# EAGLE design target (EAGLE 6.5.0)
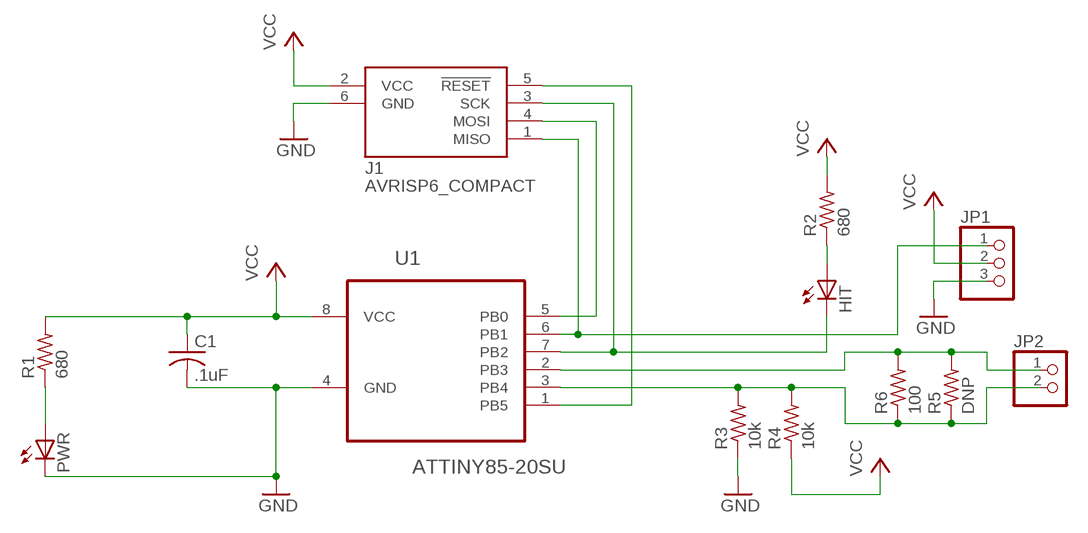
[diagram p0: schematic, sheet 1]

## Parts
C1  .1uF  C-USC0805  [C0805]
HIT  LEDSML0805  [SML0805]
J1  AVRISP6_COMPACT  [CON6P2R]
JP1  PINHD-1X3  [1X03]
JP2  PINHD-1X2  [1X02]
PWR  LEDSML0805  [SML0805]
R1  680  R-US_R0805  [R0805]
R2  680  R-US_R0805  [R0805]
R3  10k  R-US_R0805  [R0805]
R4  10k  R-US_R0805  [R0805]
R5  DNP  R-US_R0805  [R0805]
R6  100  R-US_R0805  [R0805]
U1  ATTINY85-20SU  [SOIC127P798X216-8N]

## Nets
GND: C1.2 J1.6(GND) JP1.3 PWR.C R3.1 U1.4(GND)
N$1: PWR.A R1.1
N$2: J1.5(!RESET) U1.1(PB5)
N$3: JP2.2 R3.2 R4.2 R5.1 R6.1 U1.3(PB4)
N$4: HIT.C J1.3(SCK) U1.7(PB2)
N$5: HIT.A R2.1
N$6: JP2.1 R5.2 R6.2 U1.2(PB3)
N$7: J1.4(MOSI) U1.5(PB0)
N$8: J1.1(MISO) JP1.1 U1.6(PB1)
VCC: C1.1 J1.2(VCC) JP1.2 R1.2 R2.2 R4.1 U1.8(VCC)

## Library data of the parts
C1 = rcl:C-US: CAPACITOR, American symbol; DPN: 399-1168-1-ND
HIT = led:LED: LED OSRAM: - CHIPLED LG R971, LG N971, LY N971, LG Q971, LY Q971, LO R971, LY R971 LH N974, LH R974 LS Q976, LO Q976, LY Q976 LO Q996 - Hyper CHIPLED LW Q18S LB Q993, LB Q99A, LB R99A - SideLED LS A670, LO A670, LY A670, LG A670, LP A670 LB A673, LV A673, LT A673, LW A673 LH A674 LY A675 LS A676, LA A676, LO A676, LY A676, LW A676 LS A679, LY A679, LG A679 - Hyper Micro SIDELED® LS Y876, LA Y876, LO Y876, LY Y876 LT Y87S - SmartLED LW L88C, LW L88S LB L89C, LB L89S, LG L890 LS L89K, LO L89K, LY L89K LS L896, LA L896, LO L896, LY L896 - TOPLED LS T670, LO T670, LY T670, LG T670, LP T670 LSG T670, LSP T670, LSY T670, LOP T670, LYG T670 LG T671, LOG T671, LSG T671 LB T673, LV T673, LT T673, LW T673 LH T674 LS T676, LA T676, LO T676, LY T676, LB T676, LH T676, LSB T676, LW T676 LB T67C, LV T67C, LT T67C, LS T67K, LO T67K, LY T67K, LW E67C LS E67B, LA E67B, LO E67B, LY E67B, LB E67C, LV E67C, LT E67C LW T67C LS T679, LY T679, LG T679 LS T770, LO T770, LY T770, LG T770, LP T770 LB T773, LV T773, LT T773, LW T773 LH T774 LS E675, LA E675, LY E675, LS T675 LS T776, LA T776, LO T776, LY T776, LB T776 LHGB T686 LT T68C, LB T68C - Hyper Mini TOPLED® LB M676 - Mini TOPLED Santana® LG M470 LS M47K, LO M47K, LY M47K Source: http://www.osram.convergy.de LUXEON: - LUMILED® LXK2-PW12-R00, LXK2-PW12-S00, LXK2-PW14-U00, LXK2-PW14-V00 LXK2-PM12-R00, LXK2-PM12-S00, LXK2-PM14-U00 LXK2-PE12-Q00, LXK2-PE12-R00, LXK2-PE12-S00, LXK2-PE14-T00, LXK2-PE14-U00 LXK2-PB12-K00, LXK2-PB12-L00, LXK2-PB12-M00, LXK2-PB14-N00, LXK2-PB14-P00, LXK2-PB14-Q00 LXK2-PR12-L00, LXK2-PR12-M00, LXK2-PR14-Q00, LXK2-PR14-R00 LXK2-PD12-Q00, LXK2-PD12-R00, LXK2-PD12-S00 LXK2-PH12-R00, LXK2-PH12-S00 LXK2-PL12-P00, LXK2-PL12-Q00, LXK2-PL12-R00 Source: www.luxeon.com KINGBRIGHT: KA-3528ASYC Source: www.kingbright.com; DPN: 160-1414-1-ND
J1 = target:AVRISP6: 6-pin dual-row connector for Atmel AVRISP programmer interface
JP1 = pinhead:PINHD-1X3: PIN HEADER
JP2 = pinhead:PINHD-1X2: PIN HEADER
PWR = led:LED: LED OSRAM: - CHIPLED LG R971, LG N971, LY N971, LG Q971, LY Q971, LO R971, LY R971 LH N974, LH R974 LS Q976, LO Q976, LY Q976 LO Q996 - Hyper CHIPLED LW Q18S LB Q993, LB Q99A, LB R99A - SideLED LS A670, LO A670, LY A670, LG A670, LP A670 LB A673, LV A673, LT A673, LW A673 LH A674 LY A675 LS A676, LA A676, LO A676, LY A676, LW A676 LS A679, LY A679, LG A679 - Hyper Micro SIDELED® LS Y876, LA Y876, LO Y876, LY Y876 LT Y87S - SmartLED LW L88C, LW L88S LB L89C, LB L89S, LG L890 LS L89K, LO L89K, LY L89K LS L896, LA L896, LO L896, LY L896 - TOPLED LS T670, LO T670, LY T670, LG T670, LP T670 LSG T670, LSP T670, LSY T670, LOP T670, LYG T670 LG T671, LOG T671, LSG T671 LB T673, LV T673, LT T673, LW T673 LH T674 LS T676, LA T676, LO T676, LY T676, LB T676, LH T676, LSB T676, LW T676 LB T67C, LV T67C, LT T67C, LS T67K, LO T67K, LY T67K, LW E67C LS E67B, LA E67B, LO E67B, LY E67B, LB E67C, LV E67C, LT E67C LW T67C LS T679, LY T679, LG T679 LS T770, LO T770, LY T770, LG T770, LP T770 LB T773, LV T773, LT T773, LW T773 LH T774 LS E675, LA E675, LY E675, LS T675 LS T776, LA T776, LO T776, LY T776, LB T776 LHGB T686 LT T68C, LB T68C - Hyper Mini TOPLED® LB M676 - Mini TOPLED Santana® LG M470 LS M47K, LO M47K, LY M47K Source: http://www.osram.convergy.de LUXEON: - LUMILED® LXK2-PW12-R00, LXK2-PW12-S00, LXK2-PW14-U00, LXK2-PW14-V00 LXK2-PM12-R00, LXK2-PM12-S00, LXK2-PM14-U00 LXK2-PE12-Q00, LXK2-PE12-R00, LXK2-PE12-S00, LXK2-PE14-T00, LXK2-PE14-U00 LXK2-PB12-K00, LXK2-PB12-L00, LXK2-PB12-M00, LXK2-PB14-N00, LXK2-PB14-P00, LXK2-PB14-Q00 LXK2-PR12-L00, LXK2-PR12-M00, LXK2-PR14-Q00, LXK2-PR14-R00 LXK2-PD12-Q00, LXK2-PD12-R00, LXK2-PD12-S00 LXK2-PH12-R00, LXK2-PH12-S00 LXK2-PL12-P00, LXK2-PL12-Q00, LXK2-PL12-R00 Source: www.luxeon.com KINGBRIGHT: KA-3528ASYC Source: www.kingbright.com; DPN: 160-1469-1-ND
R1 R2 = rcl:R-US_: RESISTOR, American symbol; DPN: P680ACT-ND
R3 R4 = rcl:R-US_: RESISTOR, American symbol; DPN: P10KACT-ND
R5 R6 = rcl:R-US_: RESISTOR, American symbol
U1 = Atmel_By_element14_Batch_1-00:ATTINY85-20SU: 8-bit Microcontroller with In-System Programmable Flash; DPN: ATTINY85-20SU-ND; MPN: ATTINY85-20SU; OC_FARNELL: 1455164; OC_NEWARK: 58M3797; PACKAGE: SOIC-8; SUPPLIER: Atmel

## Board
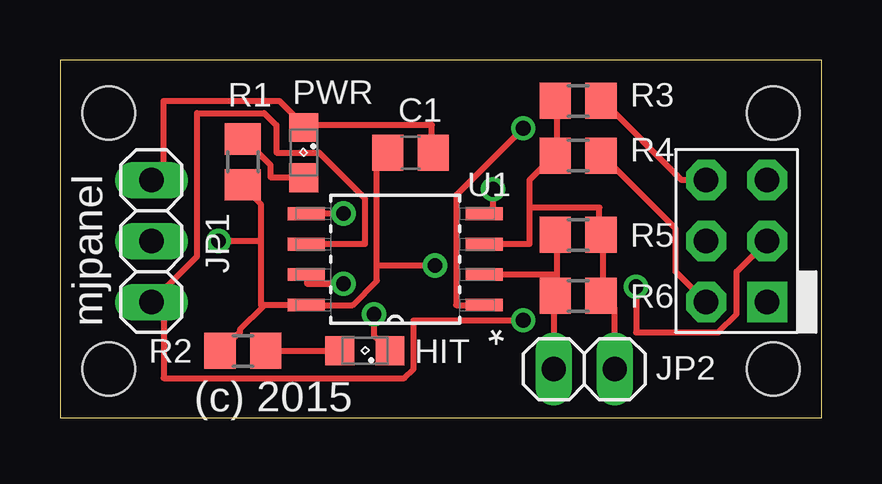
[diagram p1: board, top side]
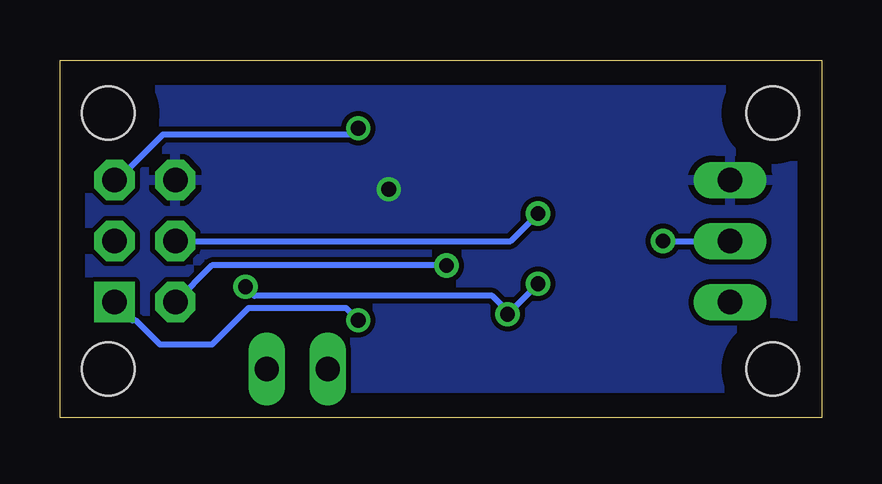
[diagram p2: board, bottom side, seen from below]

Size 31.73 x 14.91 mm. Coordinates in mm from the lower left corner, seen from the top.
Outline: 0,0 31.73,0 31.73,14.91 0,14.91 0,0
Copper layers (1*16): Top 0.035mm / dielectric 1.5mm / Bottom 0.035mm
Design rules "default": minimum track width 10mil, minimum drill 24mil, track to track 8mil, track to pad 8mil, pad to pad 8mil, via to via 8mil, smd to smd 8mil, copper to edge 40mil, drill to drill 8mil, minimum pad ring 10mil, minimum via ring 8mil, stop-mask expansion 4mil, vias tented up to drill 0mil, thermal gap 10mil
Holes 2.2 mm at 2.03,12.7 2.03,2.03 29.72,2.03 29.72,12.7

### Footprints (pad centres in the part's own frame; a part is rotated, then mirrored left to right if it is on the bottom)
C0805 = smd 1.3 x 1.5: 1 -0.95,0; 2 0.95,0
SML0805 = smd 1.2 x 1.2: A 1.05,0; C -1.05,0
CON6P2R = drill 1.016 pad 1.676 square: 1 -2.54,-1.27 | drill 1.016 pad 1.676 octagon: 2 -2.54,1.27; 3 0,-1.27; 4 0,1.27; 5 2.54,-1.27; 6 2.54,1.27
1X03 = drill 1.016 long: 1 -2.54,0; 2 0,0; 3 2.54,0
1X02 = drill 1.016 long: 1 -1.27,0; 2 1.27,0
R0805 = smd 1.3 x 1.5: 1 -0.95,0; 2 0.95,0
SOIC127P798X216-8N = smd 1.549 x 0.533: 1 -3.708,1.905; 2 -3.708,0.635; 3 -3.708,-0.635; 4 -3.708,-1.905; 5 3.708,-1.905; 6 3.708,-0.635; 7 3.708,0.635; 8 3.708,1.905

### Placement (x,y rotation side)
C1  14.61,11.05 0 top
HIT  12.7,2.79 180 top
J1  28.19,7.37 90 top
JP1  3.81,7.37 90 top
JP2  21.84,2.03 0 top
PWR  10.16,11.05 270 top
R1  7.62,10.67 270 top
R2  7.62,2.79 180 top
R3  21.59,13.21 180 top
R4  21.59,10.92 180 top
R5  21.59,7.62 180 top
R6  21.59,5.08 180 top
U1  13.97,6.6 180 top

### Tracks (layer width: path | path; a pad name or v marks a point on that pad's centre or on a via)
GND  (via drill 0.61)
  Top 0.254: 10.16,12.19 15.49,12.19 15.49,11.05 C1.2 | J1.6 25.91,9.91 22.61,13.21 R3.1 | v18.03,9.53 18.03,8.76 17.78,8.51 U1.4 | 10.16,12.19 9.14,13.21 4.32,13.21 4.32,10.41 JP1.3 | 10.16,12.19 PWR.C
  pour Bottom: 0.76,13.97 0.76,0.76 30.99,0.76 30.99,13.97
N$1
  Top 0.254: PWR.A 10.16,10.03 8.76,10.03 8.76,10.54 7.62,11.68 R1.1
N$2  (via drill 0.61)
  Top 0.254: U1.1 16.51,4.7 16.51,9.27 v19.3,12.06
  Bottom 0.254: v19.3,12.06 19.56,11.81 27.43,11.81 29.34,9.91 J1.5
N$3
  Top 0.254: R3.2 20.7,13.21 20.7,10.92 R4.2 20.57,10.92 19.56,9.91 19.56,8.76 | U1.3 19.56,7.24 19.56,8.76 | 22.61,5.08 22.61,7.62 R5.1 22.48,7.62 22.48,8.76 19.56,8.76 | 22.61,5.08 23.11,4.57 JP2.2 | 22.61,5.08 R6.1
N$4  (via drill 0.61)
  Top 0.254: v13.08,4.32 13.08,3.43 13.72,2.79 HIT.C | v11.81,5.59 10.29,5.59 10.29,5.97 U1.7 | J1.3 28.19,6.1 28.19,4.32 27.43,3.56 24,3.56 v24,5.46
  Bottom 0.254: v11.81,5.59 v13.08,4.32 13.08,4.45 13.72,5.08 23.62,5.08 v24,5.46
N$5
  Top 0.254: R2.1 HIT.A
N$6
  Top 0.254: 20.7,5.97 20.7,7.62 R5.2 | 20.7,5.97 20.7,5.08 R6.2 20.57,5.08 JP2.1 | 20.7,5.97 U1.2
N$7  (via drill 0.61)
  Top 0.254: v11.81,8.51 U1.5
  Bottom 0.254: v11.81,8.51 12.95,7.37 J1.4
N$8  (via drill 0.61)
  Top 0.254: U1.6 12.7,7.24 12.7,9.14 10.79,11.05 9.02,11.05 9.02,12.19 8.51,12.7 5.71,12.7 5.71,6.73 JP1.1 4.32,5.21 4.32,1.65 14.35,1.65 14.73,2.03 14.73,4.06 v19.3,4.06
  Bottom 0.254: J1.1 28.7,4.06 28.57,4.06 27.56,3.05 25.4,3.05 23.88,4.57 19.81,4.57 v19.3,4.06
VCC  (via drill 0.61)
  Top 0.254: J1.2 25.65,6.1 25.65,7.87 22.61,10.92 R4.1 | 8.45,4.64 8.51,4.7 U1.8 12.19,4.7 13.21,5.71 13.21,6.35 | 8.45,4.64 7.49,3.68 7.49,3.56 6.73,2.79 R2.2 | 8.38,7.37 8.38,4.7 8.45,4.64 | 8.38,7.37 8.38,8.89 7.62,9.65 R1.2 | 13.21,6.35 13.21,10.67 13.59,11.05 C1.1 | 8.38,7.37 v6.6,7.37 | 13.21,6.35 v15.62,6.35
  Bottom 0.254: v6.6,7.37 JP1.2 | J1.2 25.4,6.35 v15.62,6.35

### Text on the board
tPlace: mjpanel | (c) 2015